# EAGLE design led-drv-noemi (EAGLE 8.7.1)
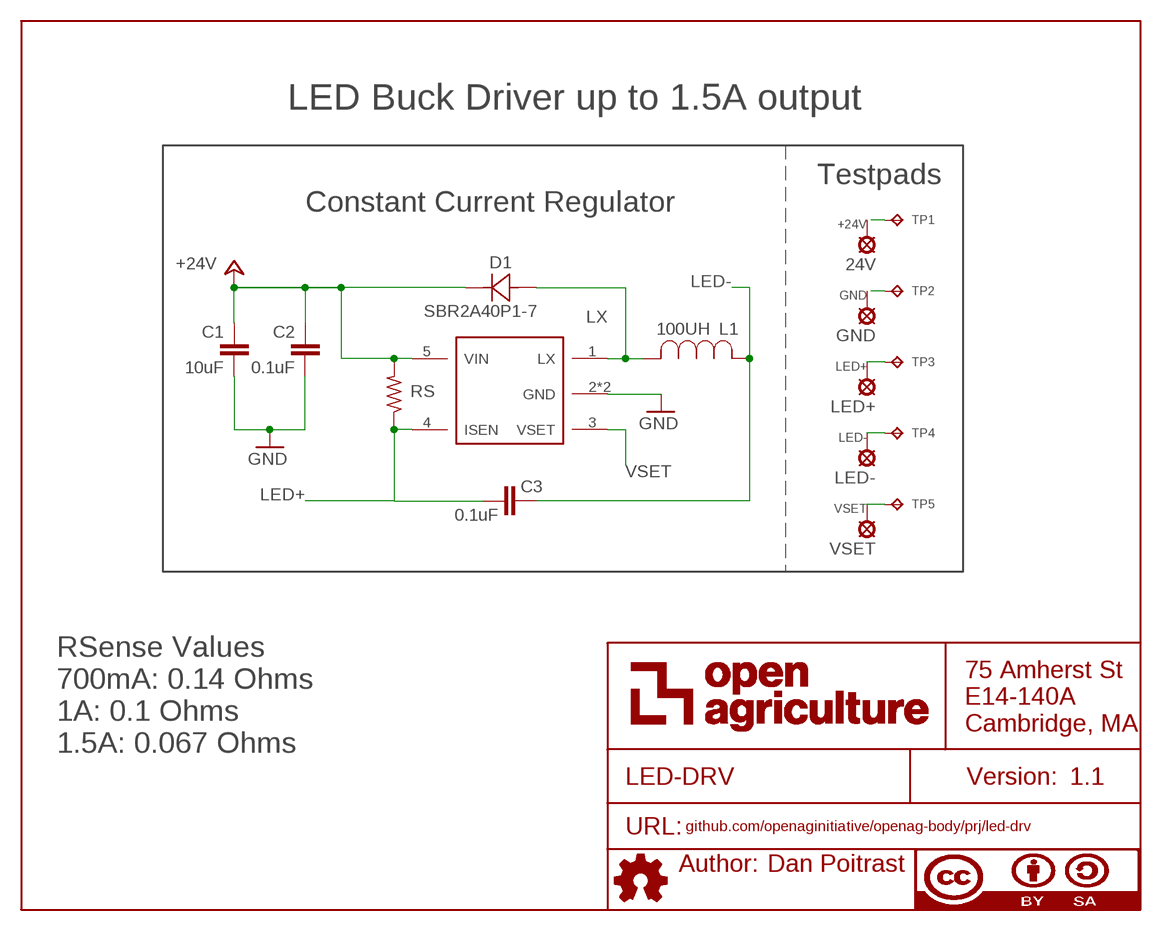
[diagram p0: schematic, sheet 1]

## Parts
24V  SE14  [SE14]
C1  10uF  10UF-GMK212BBJ106KG-T  [C0805]
C2  0.1uF  0.1UF-C0603C104K5RACTU  [C0603]
C3  0.1uF  0.1UF-C0603C104K5RACTU  [C0603]
D1  SBR2A40P1-7  [POWERDI123]
GND  SE14  [SE14]
L1  100UH  100UH_BOURNES  [IND_BOURNS_SDR1307]
LED+  SE14  [SE14]
LED-  SE14  [SE14]
RS  .06 ohms  6.3OHM-RC0805FR-076R34L  [R0805]
TP1  TPTP06R  [TP06R]
TP2  TPTP06R  [TP06R]
TP3  TPTP06R  [TP06R]
TP4  TPTP06R  [TP06R]
TP5  TPTP06R  [TP06R]
U$6  AUTHOR  [AUTHOR]
U$7  TITLE  [TITLE]
U$9  AL8861  [AL8861]
VSET  SE14  [SE14]

## Nets
+24V: 24V.MP C1.1 C2.1 D1.- RS.2 TP1.TP U$9.5(VIN)
GND: C1.2 C2.2 GND.MP TP2.TP U$9.2(GND) U$9.44(GND)
LED+: C3.2 LED+.MP RS.1 TP3.TP U$9.4(ISEN)
LED-: C3.1 L1.2 LED-.MP TP4.TP
LX: D1.+ L1.1 U$9.1(LX)
VSET: TP5.TP U$9.3(VSET) VSET.MP

## Notes on the sheet
- LED Buck Driver up to 1.5A output
- Testpads
- Constant Current Regulator
- RSense Values
  700mA: 0.14 Ohms
  1A: 0.1 Ohms
  1.5A: 0.067 Ohms

## Library data of the parts
24V GND LED+ LED- VSET = solpad:SE14: SOLDER PAD E1553, drill 1,4mm, distributor Buerklin, 07F820
C1 = openag-capacitors:10UF-GMK212BBJ106KG-T: CAP CER 10UF 35V X5R 0805 Description: 10µF ±10% 35V Ceramic Capacitor X5R 0805 (2012 Metric) Technical Specifications: Capacitance: 10µF Tolerance: ±10% Rated Voltage: 35V Temperature Coefficient: X5R Operating Temperature: -55°C ~ 85°C Package / Case: 0805 (2012 Metric) Datasheet(s): GMK212BBJ106KG-T Spec <http://ds.yuden.co.jp/TYCOMPAS/ut/detail.do?productNo=GMK212BBJ106KG-T&fileName=GMK212BBJ106KG-T_SS&mode=specSheetDownload> Vendor(s): Digikey: 587-4893-1-ND <https://www.digikey.com/product-detail/en/taiyo-yuden/GMK212BBJ106KG-T/587-4893-1-ND/6563736>; MANUFACTURER: Taiyo Yuden; MPN: GMK212BBJ106KG-T; VENDOR: Digikey; VLINK: https://www.digikey.com/product-detail/en/taiyo-yuden/GMK212BBJ106KG-T/587-4893-1-ND/6563736; VPN: 587-4893-1-ND
C2 C3 = openag-capacitors:0.1UF-C0603C104K5RACTU: CAP CER 0.1UF 50V X7R 0603 Description: 0.1µF ±10% 50V Ceramic Capacitor X7R 0603 (1608 Metric) Technical Specifications: Capacitance: 0.1µF Tolerance: ±10% Rated Voltage: 50V Temperature Coefficient: X7R Operating Temperature: -55°C ~ 125°C Package / Case: 0603 (1608 Metric) Datasheet(s): X7R Dielectric, 6.3-250 VDC <https://search.kemet.com/component-edge/download/datasheet/C0603C104K5RACTU.pdf> Vendor(s): Digikey: 399-5089-1-ND <https://www.digikey.com/product-detail/en/kemet/C0603C104K5RACTU/399-5089-1-ND/1465623>; MANUFACTURER: Kemet; MPN: C0603C104K5RACTU; VENDOR: Digikey; VLINK: https://www.digikey.com/product-detail/en/kemet/C0603C104K5RACTU/399-5089-1-ND/1465623; VPN: 399-5089-1-ND
D1 = openag-diodes:SBR2A40P1-7: DIODE SBR 40V 2A POWERDI123 Description: Diode Super Barrier 40V 2A Surface Mount PowerDI™ 123 Technical Specifications: Diode Type: Super Barrier Voltage - DC Reverse (Vr) (Max): 40V Current - Average Rectified (Io): 2A Voltage - Forward (Vf) (Max) @ If: 500mV @ 2A Speed: Standard Recovery >500ns, > 200mA (Io) Current - Reverse Leakage @ Vr: 100µA @ 40V Mounting Type: Surface Mount Package / Case: POWERDI®123 Supplier Device Package: PowerDI™ 123 Operating Temperature - Junction: -65°C ~ 150°C Base Part Number: SBR2A40 Datasheet(s): SBR2A40P1 <https://www.diodes.com/assets/Datasheets/SBR2A40P1.pdf> Vendor(s): Digikey: SBR2A40P1DITR-ND <https://www.digikey.com/product-detail/en/diodes-incorporated/SBR2A40P1-7/SBR2A40P1DITR-ND/1681825>; MANUFACTURER: Diodes Incorporated; MPN: SBR2A40P1-7; VENDOR: Digikey; VLINK: https://www.digikey.com/product-detail/en/diodes-incorporated/SBR2A40P1-7/SBR2A40P1DITR-ND/1681825; VPN: SBR2A40P1DITR-ND
L1 = openag-inductors:100UH_BOURNES: Bourne - FIXED IND 100UH 1.9A 180 MOHM Technical Specifications: Inductance: 100uH Rated Current: 1.9A Saturation Current: 3.0A DC Resistance: 180mΩ Operating Temperature: -40° C to 125°C Datasheet(s): 100uH Bourne <http://www.bourns.com/docs/Product-Datasheets/SDR1307.pdf> Vendors: Digikey: SDR1307-101KLCT-ND <https://www.digikey.com/product-detail/en/bourns-inc/SDR1307-101KL/SDR1307-101KLCT-ND/3437739>
RS = openag-resistors:6.3OHM-RC0805FR-076R34L: Yageo - RC0805FR-076R34L - RES SMD 6.34 OHM 1% 1/8W 0805 Description: 6.34 Ohms ±1% 0.125W, 1/8W Chip Resistor 0805 (2012 Metric) Moisture Resistant Thick Film Technical Specifications: Resistance: 6.34 Ohms Tolerance: ±1% Power: 0.125W, 1/8W Temperature Coefficient: ±200ppm/°C Operating Temperature: -55°C ~ 155°C Packaging / Case: 0805 (2012 Metric) Datasheet(s): RC Series, L Datasheet Vendor(s): Digikey: 311-6.34CRCT-ND <https://www.digikey.com/product-detail/en/yageo/RC0805FR-076R34L/311-6.34CRCT-ND/731003>; POPULATE: YES; VALUE: 6.34 ohm; VERIFIED: NO
TP1-TP5 = openag-testpads:TP: Test pad; MPN: N/A
U$6 = openag-frames:AUTHOR; AUTHOR: Dan Poitrast; MPN: N/A
U$7 = openag-frames:TITLE; MPN: N/A; TITLE: LED-DRV; URL: github.com/openaginitiative/openag-body/prj/led-drv; VER: 1.1
U$9 = openag-driver-IC:AL8861: AL8861 LED Driver IC Description: IC LED DRVR REG PWM 1.5A SOT89-5 Technical Specifications: Type: IC Voltage In: 4.5V - 40V Current Out: Up to 1.5A Frequency: 1Mhz Dimming: PWM or Analog Package SOT-89-5 Operating Temperature: -40°C ~ 85°C (TA) Datasheet(s): Diodes AL8861 <https://www.mouser.com/ds/2/115/AL8861-1094677.pdf> Vendor(s): Digikey: Diodes AL8861 <https://www.digikey.com/product-detail/en/diodes-incorporated/AL8861Y-13/AL8861Y-13DICT-ND/6702378>

## Board
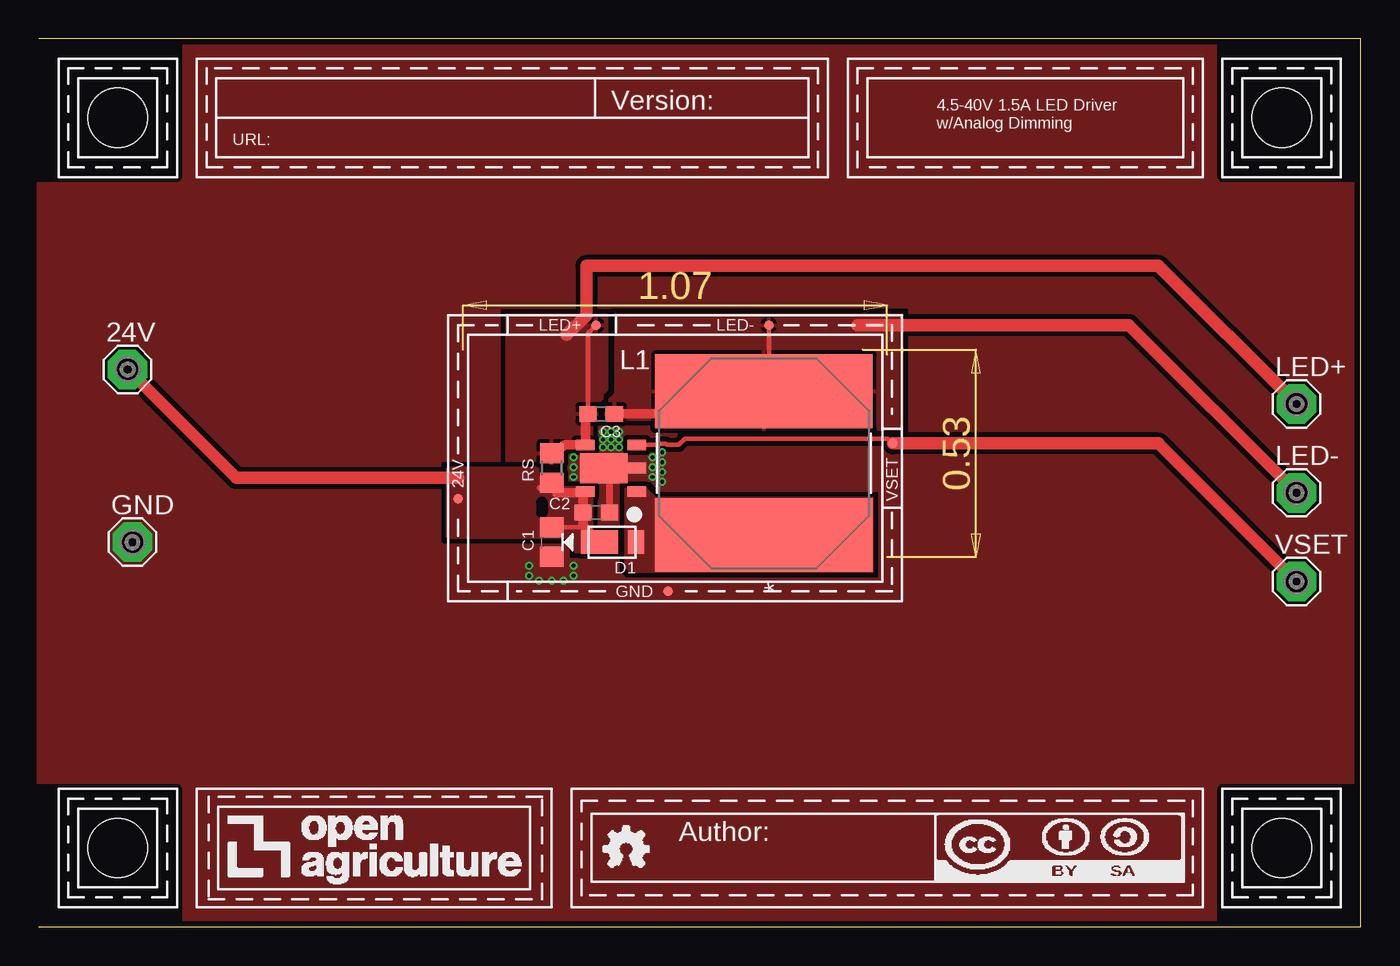
[diagram p1: board, top side]
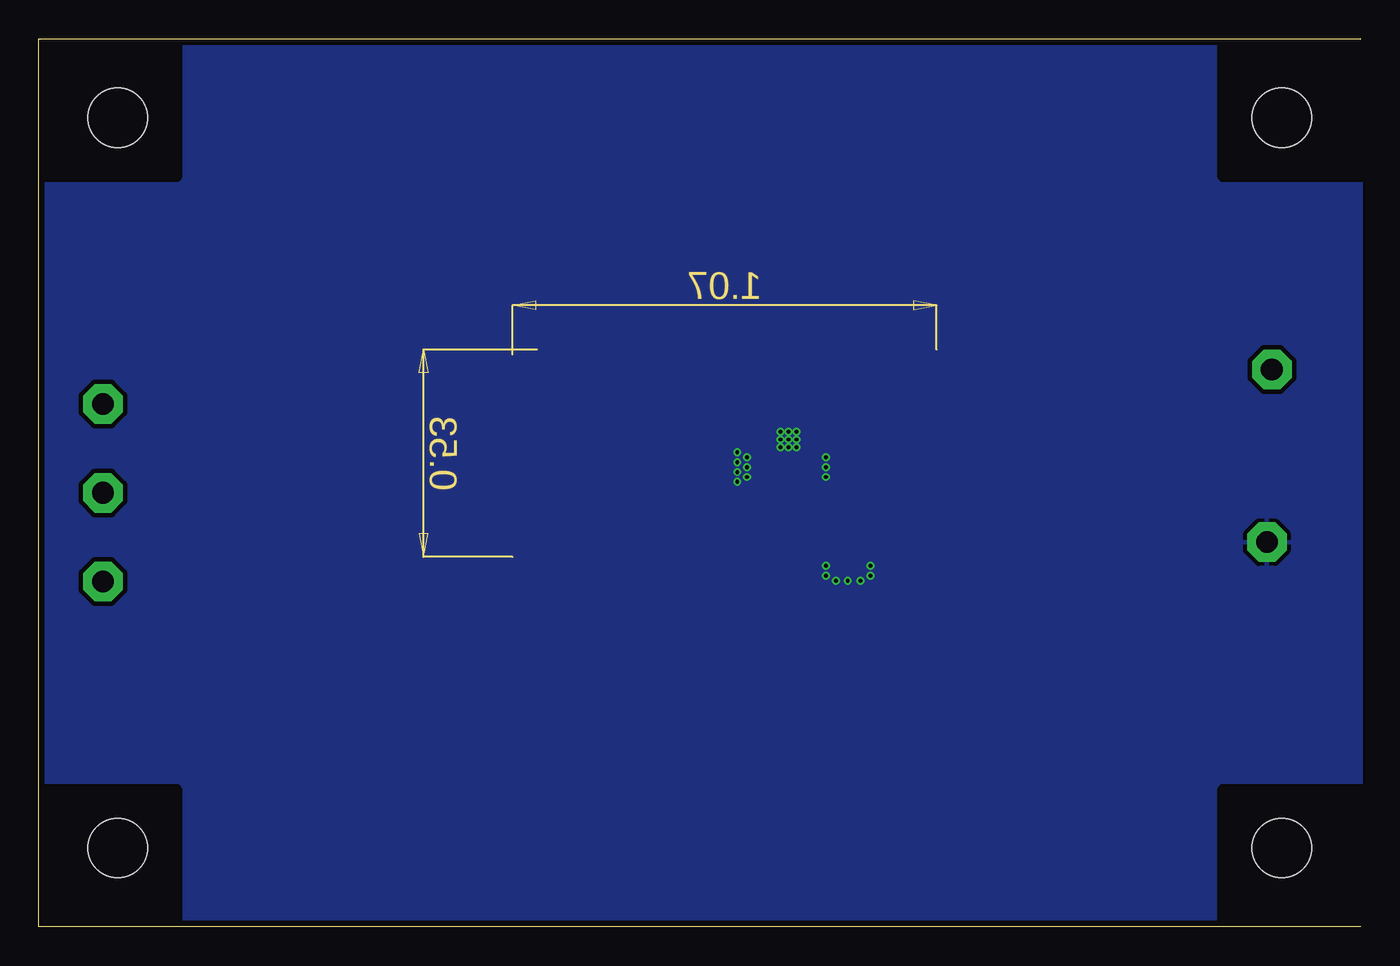
[diagram p2: board, bottom side, seen from below]

Size 85.09 x 57.15 mm. Coordinates in mm from the lower left corner, seen from the top.
Outline: 0,0 85.09,0 85.09,57.15 0,57.15
Copper layers (1*16): Top 0.035559375mm / dielectric 1.6mm / Bottom 0.035559375mm
Design rules "oshpark-2layer-mask": minimum track width 6mil, minimum drill 10mil, track to track 6mil, track to pad 6mil, pad to pad 6mil, via to via 6mil, smd to smd 6mil, copper to edge 15mil, drill to drill 6mil, minimum pad ring 5mil, minimum via ring 5mil, stop-mask expansion 2.5mil, vias tented up to drill 20mil, thermal gap 10mil
tRestrict: 1 lines
Milling: area 27.3,39.7 to 28.8,40.3; area 53.1,39.7 to 54.6,40.3; area 38.2,40.4 to 43.7,42.2; area 60,23.8 to 60.6,25.3; area 60,35.6 to 60.6,37.1; area 58.1,27.7 to 59.9,33.3; 6 lines

### Footprints (pad centres in the part's own frame; a part is rotated, then mirrored left to right if it is on the bottom)
SE14 = drill 1.397 pad 2.54 octagon: MP 0,0
C0805 = smd 1.3 x 1.5: 1 -0.95,0; 2 0.95,0
C0603 = smd 1.1 x 1: 1 -0.85,0; 2 0.85,0
POWERDI123 = smd 1.05 x 1.5: + -1.3,0 | smd 2.4 x 1.5: - 1.05,0
IND_BOURNS_SDR1307 = smd 4.75 x 13.995: 1 -4.623,0; 2 4.623,0
R0805 = smd 1.3 x 1.5: 1 -0.95,0; 2 0.95,0
TP06R = smd 0.6 x 0.6: TP 0,0
CORNER = hole 3.81: 0,0
AL8861 = smd 0.68 x 1.2: 1 -1.5,-1.65; 2 0,-1.65; 3 1.5,-1.65; 4 1.5,1.65; 5 -1.5,1.65 | smd 1.93 x 3.05: 44 0,0.475

### Placement (x,y rotation side)
24V  5.71,35.88 0 top
C1  33.02,24.77 270 top
C2  35.88,26.67 0 top
C3  36.2,33.02 180 top
D1  37.15,24.77 180 top
GND  6.03,24.77 0 top
L1  46.67,29.84 90 top
LED+  80.96,33.66 0 top
LED-  80.96,27.94 0 top
RS  33.02,29.53 270 top
TP1  26.99,27.56 270 top
TP2  40.51,21.59 270 top
TP3  35.88,38.73 0 top
TP4  46.99,38.73 270 top
TP5  54.99,31.11 0 top
U$1  [CORNER]  5.08,5.08 0 top
U$2  [CORNER]  5.08,52.07 270 top
U$3  [CORNER]  80.01,52.07 180 top
U$4  [CORNER]  80.01,5.08 90 top
U$5  [LOGO]  10.16,1.27 0 top
U$6  34.29,1.27 0 top
U$7  10.16,48.26 0 top
U$9  36.83,29.53 90 top
VSET  80.96,22.23 0 top

### Tracks (layer width: path | path; a pad name or v marks a point on that pad's centre or on a via)
+24V
  Top 0.305: C1.1 34.91,25.72 35.03,25.84
  Top 0.406: 32.27,28.26 RS.2 | 35.72,25.15 35.83,25.03
  Top 0.61: RS.2 33.34,27.94 35.24,27.94 35.03,27.73 C2.1 35.03,25.84 35.83,25.03 D1.-
  Top 0.813: 24V.MP 12.7,28.89 26.99,28.89
  pour Top (isolate 0.305, no thermals): 37.15,25.4 37.15,24.13 34.61,24.13 34.61,25.08 26.35,25.08 26.35,29.53 32.07,29.53 32.07,28.89 33.66,28.89 33.66,28.26 35.56,28.26 35.56,25.4 36.2,25.4
GND  (via drill 0.25)
  Top 0.406: C2.2 36.73,29.16 U$9.44 38.42,29.53
  other vias: 37.34,30.86 36.83,30.86 36.32,30.86 36.32,31.37 36.83,31.37 37.34,31.37 37.34,31.88 36.83,31.88 36.32,31.88 34.42,28.96 34.42,29.59 34.42,30.23 39.5,30.23 39.5,29.59 39.5,28.96 40.13,30.54 40.13,29.91 40.13,29.27 40.13,28.64 34.42,23.24 34.42,22.61 33.78,22.29 33.02,22.29 32.19,22.29 31.56,22.61 31.56,23.24
  pour Top (isolate 0.305, rank 3, no thermals): 0,0 85.09,0 85.09,57.15 0,57.15
  pour Bottom (isolate 0.305, rank 3): 0,0 85.09,0 85.09,57.15 0,57.15
LED+
  Top 0.305: C3.2 35.34,38.2 TP3.TP
  Top 0.61: RS.1 33.89,31.03 U$9.4 35.18,32.85 C3.2
  Top 0.813: LED+.MP 72.07,42.55 35.24,42.55 35.24,39.37 33.97,38.1
  pour Top (isolate 0.305, rank 2): 35.56,30.8 33.66,30.8 33.66,29.84 30.16,29.84 30.16,39.37 36.51,39.37 36.51,34.29 35.88,33.66 35.88,32.7 35.56,32.7
LED-
  Top 0.305: L1.2 46.99,34.78 TP4.TP
  Top 0.61: 40.01,33.02 C3.1
  Top 0.813: LED-.MP 70.17,38.73 52.7,38.73
  pour Top (isolate 0.305): 36.51,32.7 39.69,32.7 39.69,32.07 55.56,32.07 55.56,39.37 37.15,39.37 37.15,34.29 36.51,33.66 36.51,33.02
LX
  Top 0.61: 38.45,28 U$9.1
  pour Top (isolate 0.305, no thermals): 38.1,28.26 39.05,28.26 39.69,27.62 53.66,27.62 53.66,22.86 38.1,22.86 37.78,23.18 37.78,28.26
VSET
  Top 0.305: U$9.3 39.83,31.03 39.9,31.1 40.36,31.1 40.44,31.03 41.19,31.03 41.59,31.43 54.67,31.43 TP5.TP
  Top 0.813: VSET.MP 72.07,31.11 TP5.TP

### Text on the board
tPlace: 4.5-40V 1.5A LED Driver / w/Analog Dimming | LED+ | LED- | 24V | VSET | GND